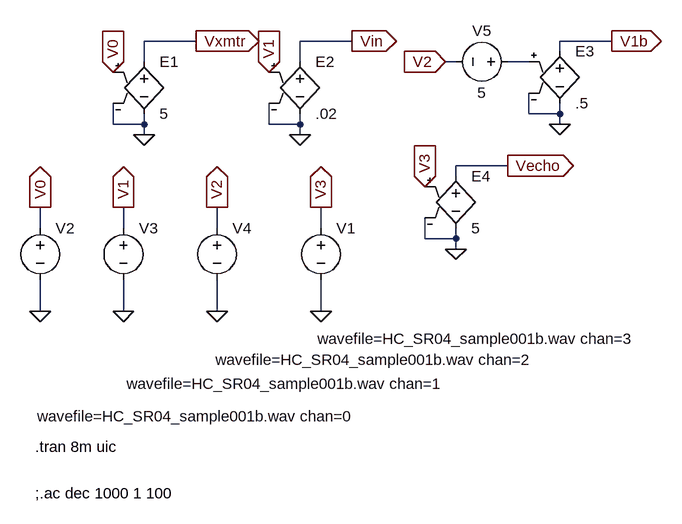
[diagram p0: schematic Lab5B3.asc]
Lab5B3.asc, the LTspice schematic file:
Version 4
SHEET 1 940 840
WIRE 192 80 112 80
WIRE 432 80 352 80
WIRE 832 80 752 80
WIRE 752 96 752 80
WIRE 112 112 112 80
WIRE 352 112 352 80
WIRE 592 112 576 112
WIRE 704 112 672 112
WIRE 704 192 704 160
WIRE 752 192 752 176
WIRE 752 192 704 192
WIRE 64 208 64 176
WIRE 112 208 112 192
WIRE 112 208 64 208
WIRE 304 208 304 176
WIRE 352 208 352 192
WIRE 352 208 304 208
WIRE 752 208 752 192
WIRE 112 224 112 208
WIRE 352 224 352 208
WIRE 672 272 592 272
WIRE 592 288 592 272
WIRE -48 368 -48 336
WIRE 80 368 80 336
WIRE 224 368 224 336
WIRE 384 368 384 336
WIRE 544 384 544 352
WIRE 592 384 592 368
WIRE 592 384 544 384
WIRE 592 400 592 384
WIRE -48 496 -48 448
WIRE 80 496 80 448
WIRE 224 496 224 448
WIRE 384 496 384 448
FLAG 112 224 0
FLAG 352 224 0
FLAG 752 208 0
FLAG 592 400 0
FLAG 384 496 0
FLAG 224 496 0
FLAG 80 496 0
FLAG -48 496 0
FLAG 64 128 V0
IOPIN 64 128 In
FLAG 304 128 V1
IOPIN 304 128 In
FLAG 544 304 V3
IOPIN 544 304 In
FLAG -48 336 V0
IOPIN -48 336 Out
FLAG 80 336 V1
IOPIN 80 336 Out
FLAG 224 336 V2
IOPIN 224 336 Out
FLAG 384 336 V3
IOPIN 384 336 Out
FLAG 672 272 Vecho
IOPIN 672 272 Out
FLAG 832 80 V1b
IOPIN 832 80 Out
FLAG 432 80 Vin
IOPIN 432 80 Out
FLAG 192 80 Vxmtr
IOPIN 192 80 Out
FLAG 576 112 V2
IOPIN 576 112 In
SYMBOL e 112 96 R0
SYMATTR InstName E1
SYMATTR Value 5
SYMBOL e 352 96 R0
SYMATTR InstName E2
SYMATTR Value .02
SYMBOL e 752 80 R0
SYMATTR InstName E3
SYMATTR Value .5
SYMBOL e 592 272 R0
SYMATTR InstName E4
SYMATTR Value 5
SYMBOL voltage 384 352 R0
WINDOW 123 0 0 Left 0
WINDOW 39 0 0 Left 0
WINDOW 3 -5 186 Left 2
SYMATTR InstName V1
SYMATTR Value wavefile=HC_SR04_sample001b.wav chan=3
SYMBOL voltage -48 352 R0
WINDOW 3 -5 305 Left 2
SYMATTR InstName V2
SYMATTR Value wavefile=HC_SR04_sample001b.wav chan=0
SYMBOL voltage 80 352 R0
WINDOW 3 5 255 Left 2
SYMATTR InstName V3
SYMATTR Value wavefile=HC_SR04_sample001b.wav chan=1
SYMBOL voltage 224 352 R0
WINDOW 123 0 0 Left 0
WINDOW 39 0 0 Left 0
WINDOW 3 -2 218 Left 2
SYMATTR InstName V4
SYMATTR Value wavefile=HC_SR04_sample001b.wav chan=2
SYMBOL voltage 688 112 R90
WINDOW 0 -32 56 VBottom 2
WINDOW 3 32 56 VTop 2
WINDOW 123 0 0 Left 0
WINDOW 39 0 0 Left 0
SYMATTR InstName V5
SYMATTR Value 5
TEXT -56 704 Left 2 !.tran 8m uic
TEXT -56 776 Left 2 !;.ac dec 1000 1 100

The netlist it stands for:
* Lab5B3.asc
E1 Vxmtr 0 V0 0 5
E2 Vin 0 V1 0 .02
E3 V1b 0 N001 0 .5
E4 Vecho 0 V3 0 5
V1 V3 0 wavefile=HC_SR04_sample001b.wav chan=3
V2 V0 0 wavefile=HC_SR04_sample001b.wav chan=0
V3 V1 0 wavefile=HC_SR04_sample001b.wav chan=1
V4 V2 0 wavefile=HC_SR04_sample001b.wav chan=2
V5 N001 V2 5
.tran 8m uic
;.ac dec 1000 1 100
.backanno
.end